# Altium project Arduino_Nano_V3.3.PrjPcb
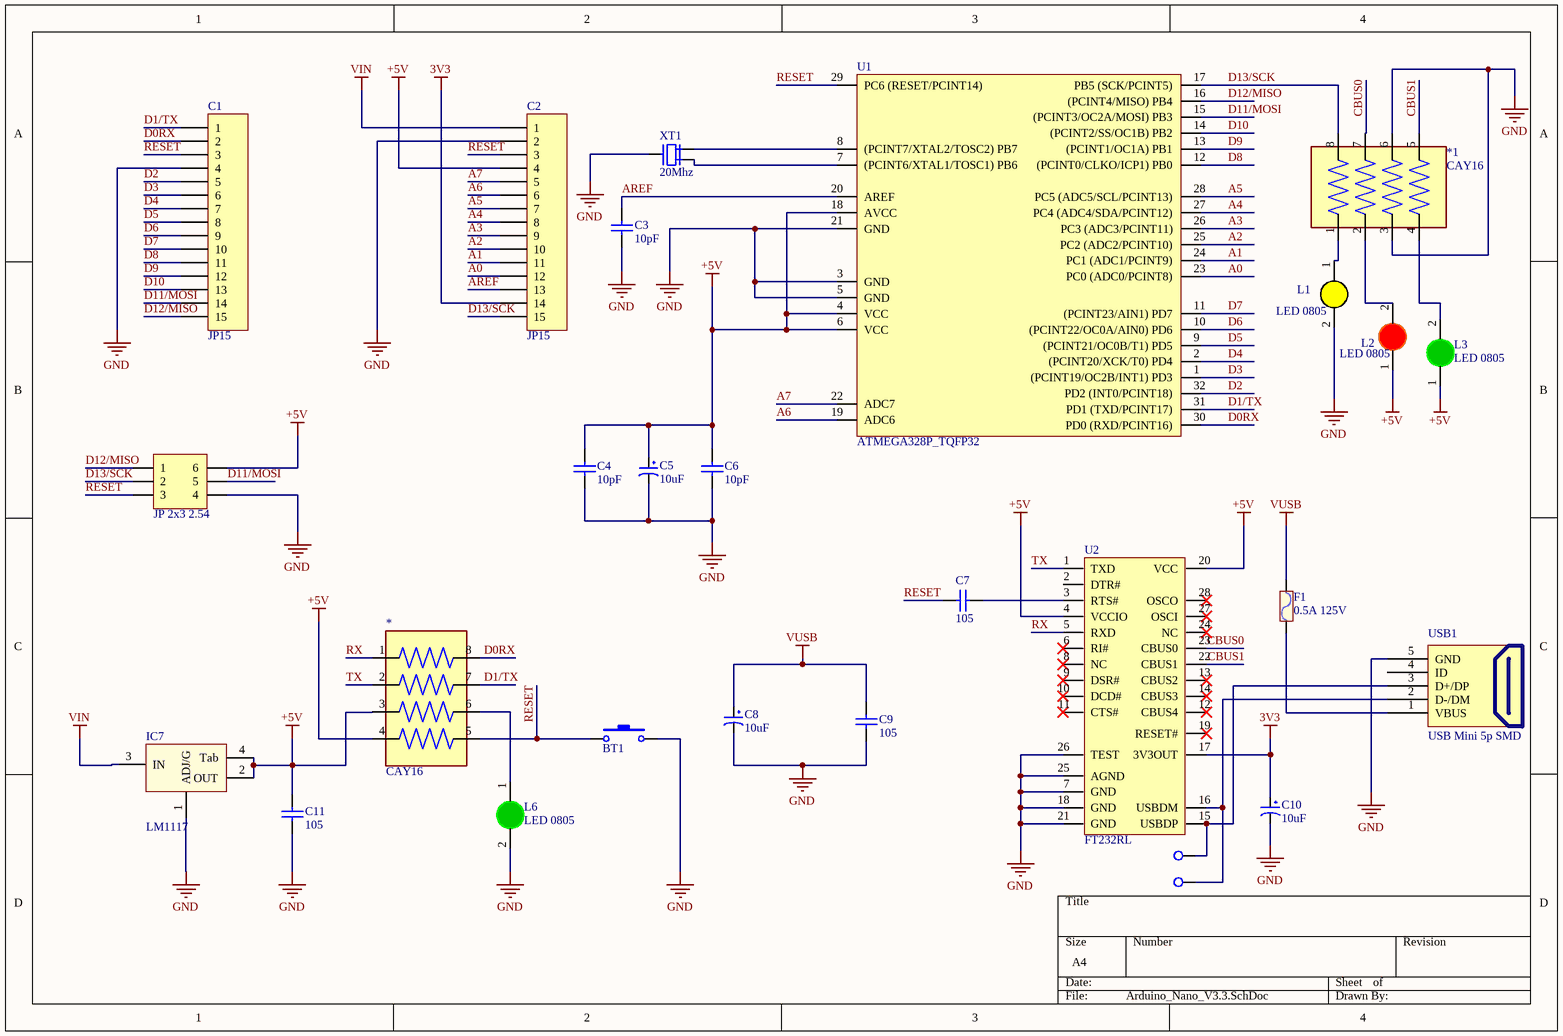
[diagram p0: Arduino_Nano_V3.3.SchDoc]
1 sheet, 27 parts. Net scope: global (net labels, ports and power ports of the same name join across sheets).
Board file: Arduino_Nano_V3.3.PcbDoc

## Sheet Arduino_Nano_V3.3.SchDoc
size A4; SheetNumber: 1; SheetTotal: 1

### Parts
*  CAY16  [CAY16]
*1  CAY16  [CAY16]
BT1  Nut Nhan 2 Chan SMD 3x6x2.5  [Nut Nhan 2 Chan SMD 3x6x2.5]  (value not drawn)
C1  JP15  [JP15-D1T]
C2  JP15  [JP15-D1T]
C3  10pF  [tu 0805]
C4  10pF  [tu 0805]
C5  10uF  [tu tantalum smd3216]
C6  10pF  [tu 0805]
C7  105  [tu 0805]
C8  10uF  [tu tantalum smd3216]
C9  105  [tu 0805]
C10  10uF  [tu tantalum smd3216]
C11  105  [tu 0805]
F1  0.5A 125V  [Cau Chi SMD1808]
IC7  LM1117  [SOT223-4N]
JP1  JP 2x3 2.54  [JP 2x3 DT]
L1  LED 0805  [LED-1206-Yellow]
L2  LED 0805  [LED-1206-Red]
L3  LED 0805  [LED-1206-Green]
L6  LED 0805  [LED-1206-Green]
TP_D+  TP_D+  [TP]  (value not drawn)
TP_D-  TP_D-  [TP]  (value not drawn)
U1  ATMEGA328P_TQFP32  [TQFP32]
U2  FT232RL  [SSOP28]
USB1  USB Mini 5p SMD  [USB Mini 5p SMD]
XT1  20Mhz  [Thach Anh 3 Chan SMD]

### Nets
3V3: C2.14 C10.1 U2.17(3V3OUT)
+5V: *.4 C2.4 C4.1 C5.1 C6.1 C11.2 IC7.2(OUT) IC7.4(Tab) JP1.6 L2.1(A) L3.1(A) U1.4(VCC) U1.6(VCC) U1.18(AVCC) U2.4(VCCIO) U2.20(VCC)
GND: *1.3 *1.6 BT1.2 C1.4 C2.2 C3.2 C4.2 C5.2 C6.2 C8.2 C9.2 C10.2 C11.1 IC7.1(ADJ/G) JP1.4 L1.2(K) L6.2(K) U1.3(GND) U1.5(GND) U1.21(GND) U2.7(GND) U2.18(GND) U2.21(GND) U2.25(AGND) U2.26(TEST) USB1.5(GND) XT1.2
VIN: C2.1 IC7.3(IN)
VUSB: C8.1 C9.1 F1.2
A0: C2.12 U1.23(PC0_(ADC0/PCINT8))
A1: C2.11 U1.24(PC1_(ADC1/PCINT9))
A2: C2.10 U1.25(PC2_(ADC2/PCINT10))
A3: C2.9 U1.26(PC3_(ADC3/PCINT11))
A4: C2.8 U1.27(PC4_(ADC4/SDA/PCINT12))
A5: C2.7 U1.28(PC5_(ADC5/SCL/PCINT13))
A6: C2.6 U1.19(ADC6)
A7: C2.5 U1.22(ADC7)
AREF: C2.13 C3.1 U1.20(AREF)
CBUS0: *1.7 U2.23(CBUS0)
CBUS1: *1.5 U2.22(CBUS1)
D0RX: *.8 C1.2 U1.30(PD0_(RXD/PCINT16))
D1/TX: *.7 C1.1 U1.31(PD1_(TXD/PCINT17))
D2: C1.5 U1.32(PD2_(INT0/PCINT18))
D3: C1.6 U1.1((PCINT19/OC2B/INT1)_PD3)
D4: C1.7 U1.2((PCINT20/XCK/T0)_PD4)
D5: C1.8 U1.9((PCINT21/OC0B/T1)_PD5)
D6: C1.9 U1.10((PCINT22/OC0A/AIN0)_PD6)
D7: C1.10 U1.11((PCINT23/AIN1)_PD7)
D8: C1.11 U1.12((PCINT0/CLKO/ICP1)_PB0)
D9: C1.12 U1.13((PCINT1/OC1A)_PB1)
D10: C1.13 U1.14((PCINT2/SS/OC1B)_PB2)
D11/MOSI: C1.14 JP1.5 U1.15((PCINT3/OC2A/MOSI)_PB3)
D12/MISO: C1.15 JP1.1 U1.16((PCINT4/MISO)_PB4)
D13/SCK: *1.8 C2.15 JP1.2 U1.17(PB5_(SCK/PCINT5))
RESET: *.5 BT1.1 C1.3 C2.3 C7.1 JP1.3 U1.29(PC6_(RESET/PCINT14))
RX: *.1 U2.5(RXD)
TX: *.2 U2.1(TXD)
Net*1_1: *1.1 L1.1(A)
Net*1_2: *1.2 L2.2(K)
Net*1_4: *1.4 L3.2(K)
Net*_6: *.6 L6.1(A)
NetC7_2: C7.2 U2.3(RTS#)
NetF1_1: F1.1 USB1.1(VBUS)
NetTP_D+_1: TP_D+.1 U2.15(USBDP) USB1.3(D+/DP)
NetTP_D-_1: TP_D-.1 U2.16(USBDM) USB1.2(D-/DM)
NetU1_7: U1.7((PCINT6/XTAL1/TOSC1)_PB6) XT1.1
NetU1_8: U1.8((PCINT7/XTAL2/TOSC2)_PB7) XT1.3

Not connected (* = marked no-connect by the designer): * 3; U2 2(DTR#) 6(RI#)* 8(NC)* 9(DSR#)* 10(DCD#)* 11(CTS#)* 12(CBUS4)* 13(CBUS2)* 14(CBUS3)* 19(RESET#)* 24(NC)* 27(OSCI)* 28(OSCO)*; USB1 4(ID)

### Library data of the parts
BT1 = Nut Nhan 2 Chan SMD 3x6x2.5: Ma_Hang: MH001036; Ten: Nút Nhấn 2 Chân 3x6x2.5MM SMD
C1 C2 = JP15: WR-PHD 2.54 mm Angled Socket Header; Manufacturer: W¨¹rth Elektronik eiSos GmbH; partNo: 613015143121; ComponentLink1 Description: Manufacturer; ComponentLink2 Description: Datasheet; NoPins: 15; Created Date: 29 March 2013; ComponentLink1URL: http://www.we-online.com; ComponentLink2URL: http://katalog.we-online.de/em/datasheet/6130xx143121.pdf; Created by: Karrer Zheng
C3 C4 C6 = Tu 0805 10pF 50V 10%: Dán; Don_Vi: Con; So_Chan: 2; Ten_Linh_Kien: Tụ 0805 10P 10% 50V; Ma_Hang: MH004554; Chung_Loai: Dán; Kieu_Chan: *
C5 C8 C10 = Tu tantalum 10uF 16V SMD3216: Dán; Don_Vi: Con; So_Chan: 2; Ten_Linh_Kien: Tụ tantalum 106C-10uF 16V SMD3216; Ma_Hang: MH001954; Chung_Loai: Dán; Kieu_Chan: *
C7 C9 C11 = Tu 0805 105 50V 10%: Dán; Don_Vi: Con; So_Chan: 2; Ten_Linh_Kien: Tụ 0805 105-1uF 10% 50V; Ma_Hang: MH004552; Chung_Loai: Dán; Kieu_Chan: *
F1 = Cau chi 0.5A 125V SMD1808: Ma_Hang: MH009241; Ten: Cầu Chì 0.5A 125V SMD1808 0451.500MRL
IC7 = LM1117: 3v3; Value: LM317
JP1 = JP 2x3 2.54 Duc Thang: Cắm; Ten_Linh_Kien: Jump Đôi Đực 2.54MM 2x40P Thẳng 11MM; Don_Vi: Con; Ma_Hang: MH002686; Ghi_Chu: *; Kieu_Chan: *; Chung_Loai: Cắm
L1 = LED 1206 Vang: Dán; Don_Vi: Con; Ma_Hang: MH002331; Ten_Linh_Kien: LED1206 Màu Vàng (Yellow); Ghi_Chu: *; Kieu_Chan: *; Chung_Loai: Dán
L2 = LED 1206 Do: Dán; Don_Vi: Con; Ma_Hang: MH002334; Ten_Linh_Kien: LED1206 Màu Đỏ (Red); Ghi_Chu: *; Kieu_Chan: *; Chung_Loai: Dán
L3 L6 = LED 1206 Xanh La: Dán; Don_Vi: Con; Ma_Hang: MH002947; Ten_Linh_Kien: LED1206 Màu Xanh Lá (Green); Ghi_Chu: *; Kieu_Chan: *; Chung_Loai: Dán
TP_D+ TP_D- = TP
U1 = ATMEGA328P
USB1 = USB Mini 5p SMD: USB Type B; Ten: MiniUSB 5P SMD; Ma_Hang: MH001022
XT1 = Thach anh 3 Chan SMD: Crystal For all Crystal 2pin.; Value: 4Mhz